# EAGLE schematic circuit-business-card (EAGLE 9.6.2)
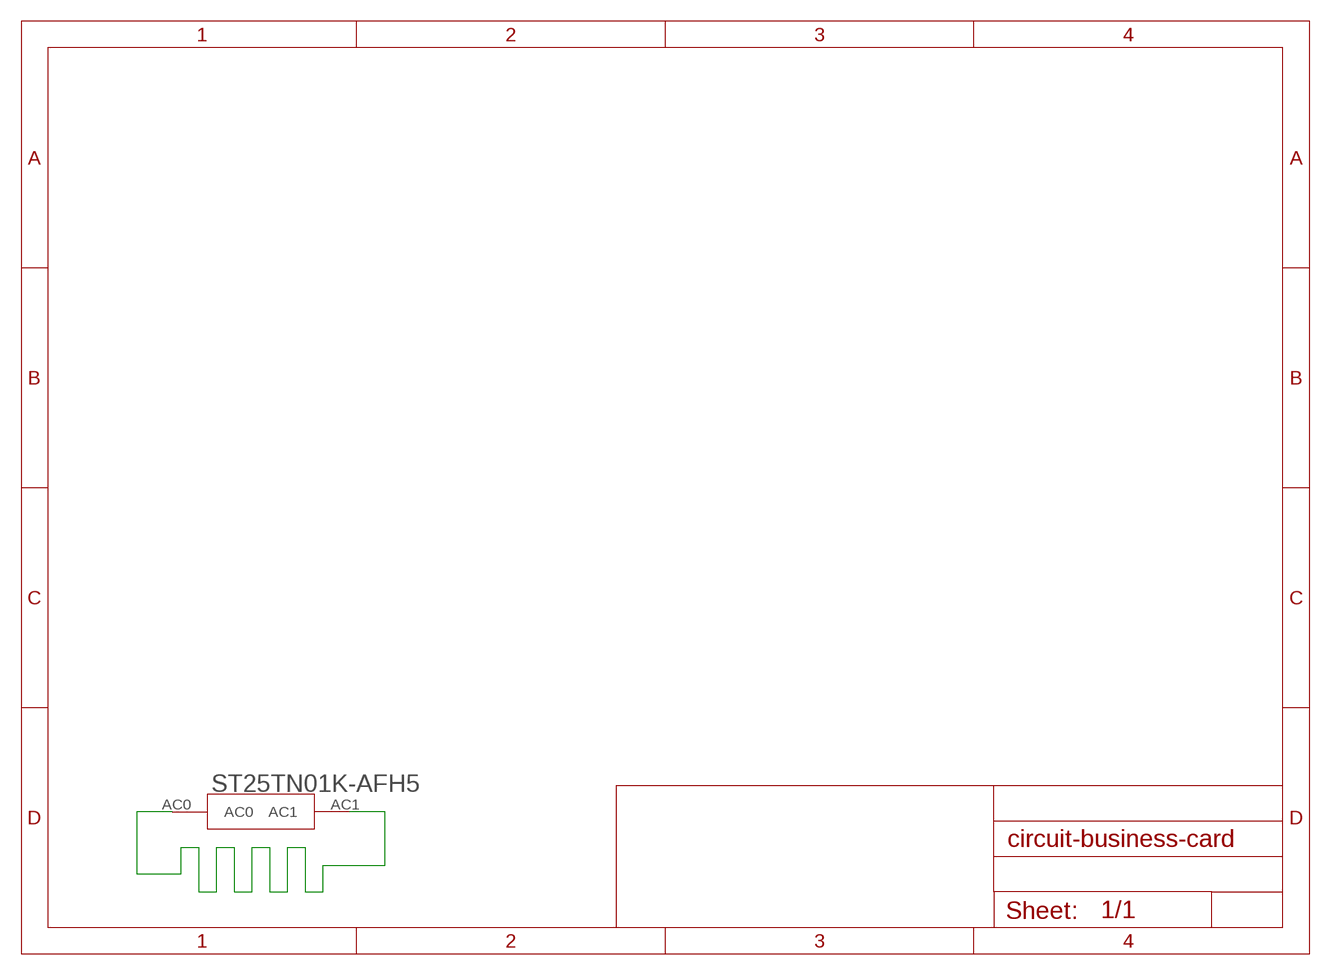
[diagram p0: schematic, sheet 1]

## Parts
U1  ST25TN01K-AFH5  [UFDFPN5]

## Nets
N$1: U1.AC0 U1.AC1

## Library data of the parts
U1 = ST25TN01K-AFH5:ST25TN01K-AFH5